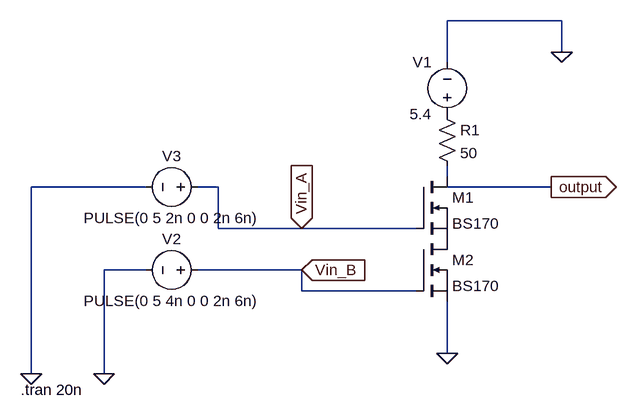
[diagram p0: schematic and_mos.asc]
and_mos.asc, the LTspice schematic file:
Version 4.1
SHEET 1 880 680
WIRE 400 -224 224 -224
WIRE 400 -176 400 -224
WIRE 224 -160 224 -224
WIRE 224 16 224 0
WIRE -240 32 -416 32
WIRE -128 32 -160 32
WIRE 384 32 224 32
WIRE -128 96 -128 32
WIRE 0 96 -128 96
WIRE 176 96 0 96
WIRE -240 160 -304 160
WIRE 0 160 -160 160
WIRE 0 192 0 160
WIRE 176 192 0 192
WIRE 224 288 224 208
WIRE -416 320 -416 32
WIRE -304 320 -304 160
FLAG 0 96 Vin_A
IOPIN 0 96 In
FLAG 0 160 Vin_B
IOPIN 0 160 In
FLAG -304 320 0
FLAG -416 320 0
FLAG 400 -176 0
FLAG 224 288 0
FLAG 384 32 output
IOPIN 384 32 Out
SYMBOL voltage 224 -64 R180
WINDOW 0 24 96 Left 2
WINDOW 3 24 16 Left 2
WINDOW 123 0 0 Left 0
WINDOW 39 0 0 Left 0
SYMATTR InstName V1
SYMATTR Value 5.4
SYMBOL res 208 -96 R0
SYMATTR InstName R1
SYMATTR Value 50
SYMBOL voltage -144 160 R90
WINDOW 0 -32 56 VBottom 2
WINDOW 3 32 56 VTop 2
WINDOW 123 0 0 Left 0
WINDOW 39 0 0 Left 0
SYMATTR InstName V2
SYMATTR Value PULSE(0 5 4n 0 0 2n 6n)
SYMBOL voltage -144 32 R90
WINDOW 0 -32 56 VBottom 2
WINDOW 3 32 56 VTop 2
WINDOW 123 0 0 Left 0
WINDOW 39 0 0 Left 0
SYMATTR InstName V3
SYMATTR Value PULSE(0 5 2n 0 0 2n 6n)
SYMBOL nmos 176 16 R0
SYMATTR InstName M1
SYMATTR Value BS170
SYMBOL nmos 176 112 R0
SYMATTR InstName M2
SYMATTR Value BS170
TEXT -432 344 Left 2 !.tran 20n

The netlist it stands for:
* and_mos.asc
V1 P001 0 5.4
R1 P001 N001 50
V2 Vin_B 0 PULSE(0 5 4n 0 0 2n 6n)
V3 Vin_A 0 PULSE(0 5 2n 0 0 2n 6n)
M1 N001 Vin_A P002 P002 BS170
M2 P002 Vin_B 0 0 BS170
.model NMOS NMOS
.model PMOS PMOS
.lib standard.mos
.tran 20n
.backanno
.end